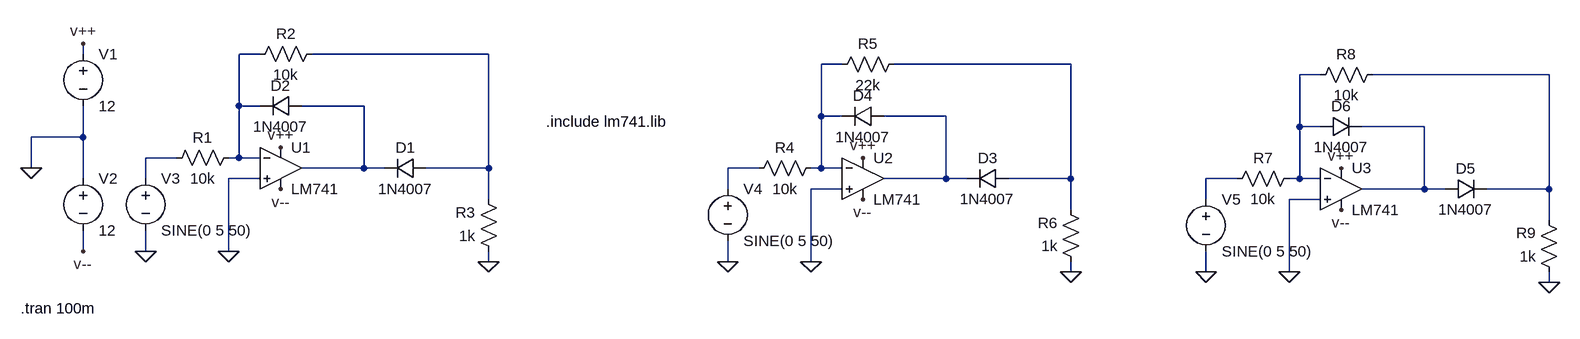
[diagram p0: schematic Rectificador de precisión.asc]
Rectificador de precisión.asc, the LTspice schematic file:
Version 4
SHEET 1 2052 680
WIRE -224 -32 -224 -48
WIRE 48 -32 16 -32
WIRE 400 -32 128 -32
WIRE 944 -16 912 -16
WIRE 1296 -16 1024 -16
WIRE 1680 0 1648 0
WIRE 2032 0 1760 0
WIRE 16 48 16 -32
WIRE 48 48 16 48
WIRE 208 48 112 48
WIRE 912 64 912 -16
WIRE 944 64 912 64
WIRE 1104 64 1008 64
WIRE 1648 80 1648 0
WIRE 1680 80 1648 80
WIRE 1840 80 1744 80
WIRE -224 96 -224 48
WIRE -224 96 -304 96
WIRE -80 128 -128 128
WIRE 16 128 16 48
WIRE 16 128 0 128
WIRE 48 128 16 128
WIRE -304 144 -304 96
WIRE 208 144 208 48
WIRE 208 144 112 144
WIRE 240 144 208 144
WIRE 400 144 400 -32
WIRE 400 144 304 144
WIRE 816 144 768 144
WIRE 912 144 912 64
WIRE 912 144 896 144
WIRE 944 144 912 144
WIRE -224 160 -224 96
WIRE -128 160 -128 128
WIRE 48 160 0 160
WIRE 1104 160 1104 64
WIRE 1104 160 1008 160
WIRE 1136 160 1104 160
WIRE 1296 160 1296 -16
WIRE 1296 160 1200 160
WIRE 1552 160 1504 160
WIRE 1648 160 1648 80
WIRE 1648 160 1632 160
WIRE 1680 160 1648 160
WIRE 768 176 768 144
WIRE 944 176 896 176
WIRE 1840 176 1840 80
WIRE 1840 176 1744 176
WIRE 1872 176 1840 176
WIRE 2032 176 2032 0
WIRE 2032 176 1936 176
WIRE 400 192 400 144
WIRE 1504 192 1504 160
WIRE 1680 192 1632 192
WIRE 1296 208 1296 160
WIRE 2032 224 2032 176
WIRE -224 272 -224 240
WIRE -128 272 -128 240
WIRE 0 272 0 160
WIRE 400 288 400 272
WIRE 768 288 768 256
WIRE 896 288 896 176
WIRE 1296 304 1296 288
WIRE 1504 304 1504 272
WIRE 1632 304 1632 192
WIRE 2032 320 2032 304
FLAG -304 144 0
FLAG -128 272 0
FLAG 0 272 0
FLAG 400 288 0
FLAG -224 -48 v++
FLAG 80 112 v++
FLAG -224 272 v--
FLAG 80 176 v--
FLAG 768 288 0
FLAG 896 288 0
FLAG 1296 304 0
FLAG 976 128 v++
FLAG 976 192 v--
FLAG 1504 304 0
FLAG 1632 304 0
FLAG 2032 320 0
FLAG 1712 144 v++
FLAG 1712 208 v--
SYMBOL OpAmps\\opamp2 80 80 R0
SYMATTR InstName U1
SYMATTR Value LM741
SYMBOL diode 304 128 R90
WINDOW 0 0 32 VBottom 2
WINDOW 3 32 32 VTop 2
SYMATTR InstName D1
SYMATTR Value 1N4007
SYMBOL diode 112 32 R90
WINDOW 0 0 32 VBottom 2
WINDOW 3 32 32 VTop 2
SYMATTR InstName D2
SYMATTR Value 1N4007
SYMBOL voltage -224 -48 R0
WINDOW 123 0 0 Left 0
WINDOW 39 0 0 Left 0
SYMATTR InstName V1
SYMATTR Value 12
SYMBOL voltage -224 144 R0
WINDOW 123 0 0 Left 0
WINDOW 39 0 0 Left 0
SYMATTR InstName V2
SYMATTR Value 12
SYMBOL res 16 112 R90
WINDOW 0 0 56 VBottom 2
WINDOW 3 32 56 VTop 2
SYMATTR InstName R1
SYMATTR Value 10k
SYMBOL res 144 -48 R90
WINDOW 0 0 56 VBottom 2
WINDOW 3 32 56 VTop 2
SYMATTR InstName R2
SYMATTR Value 10k
SYMBOL res 416 288 R180
WINDOW 0 36 76 Left 2
WINDOW 3 36 40 Left 2
SYMATTR InstName R3
SYMATTR Value 1k
SYMBOL voltage -128 144 R0
WINDOW 123 0 0 Left 0
WINDOW 39 0 0 Left 0
SYMATTR InstName V3
SYMATTR Value SINE(0 5 50)
SYMBOL OpAmps\\opamp2 976 96 R0
SYMATTR InstName U2
SYMATTR Value LM741
SYMBOL diode 1200 144 R90
WINDOW 0 0 32 VBottom 2
WINDOW 3 32 32 VTop 2
SYMATTR InstName D3
SYMATTR Value 1N4007
SYMBOL diode 1008 48 R90
WINDOW 0 0 32 VBottom 2
WINDOW 3 32 32 VTop 2
SYMATTR InstName D4
SYMATTR Value 1N4007
SYMBOL res 912 128 R90
WINDOW 0 0 56 VBottom 2
WINDOW 3 32 56 VTop 2
SYMATTR InstName R4
SYMATTR Value 10k
SYMBOL res 1040 -32 R90
WINDOW 0 0 56 VBottom 2
WINDOW 3 32 56 VTop 2
SYMATTR InstName R5
SYMATTR Value 22k
SYMBOL res 1312 304 R180
WINDOW 0 36 76 Left 2
WINDOW 3 36 40 Left 2
SYMATTR InstName R6
SYMATTR Value 1k
SYMBOL voltage 768 160 R0
WINDOW 123 0 0 Left 0
WINDOW 39 0 0 Left 0
SYMATTR InstName V4
SYMATTR Value SINE(0 5 50)
SYMBOL OpAmps\\opamp2 1712 112 R0
SYMATTR InstName U3
SYMATTR Value LM741
SYMBOL res 1648 144 R90
WINDOW 0 0 56 VBottom 2
WINDOW 3 32 56 VTop 2
SYMATTR InstName R7
SYMATTR Value 10k
SYMBOL res 1776 -16 R90
WINDOW 0 0 56 VBottom 2
WINDOW 3 32 56 VTop 2
SYMATTR InstName R8
SYMATTR Value 10k
SYMBOL res 2048 320 R180
WINDOW 0 36 76 Left 2
WINDOW 3 36 40 Left 2
SYMATTR InstName R9
SYMATTR Value 1k
SYMBOL voltage 1504 176 R0
WINDOW 123 0 0 Left 0
WINDOW 39 0 0 Left 0
SYMATTR InstName V5
SYMATTR Value SINE(0 5 50)
SYMBOL diode 1680 96 R270
WINDOW 0 32 32 VTop 2
WINDOW 3 0 32 VBottom 2
SYMATTR InstName D6
SYMATTR Value 1N4007
SYMBOL diode 1872 192 R270
WINDOW 0 32 32 VTop 2
WINDOW 3 0 32 VBottom 2
SYMATTR InstName D5
SYMATTR Value 1N4007
TEXT 488 72 Left 2 !.include lm741.lib
TEXT -320 360 Left 2 !.tran 100m

The netlist it stands for:
* Rectificador de precisión.asc
XU1 0 N001 v++ v-- N007 LM741  ; pins In+ In- V+ V- OUT
D1 N002 N007 1N4007
D2 N007 N001 1N4007
V1 v++ 0 12
V2 0 v-- 12
R1 N001 N010 10k
R2 N002 N001 10k
R3 0 N002 1k
V3 N010 0 SINE(0 5 50)
XU2 0 N003 v++ v-- N008 LM741  ; pins In+ In- V+ V- OUT
D3 N004 N008 1N4007
D4 N008 N003 1N4007
R4 N003 N011 10k
R5 N004 N003 22k
R6 0 N004 1k
V4 N011 0 SINE(0 5 50)
XU3 0 N005 v++ v-- N009 LM741  ; pins In+ In- V+ V- OUT
R7 N005 N012 10k
R8 N006 N005 10k
R9 0 N006 1k
V5 N012 0 SINE(0 5 50)
D6 N005 N009 1N4007
D5 N009 N006 1N4007
.model D D
.lib standard.dio
.include lm741.lib
.tran 100m
.backanno
.end